# EAGLE design temp_sensing (EAGLE 9.5.2)
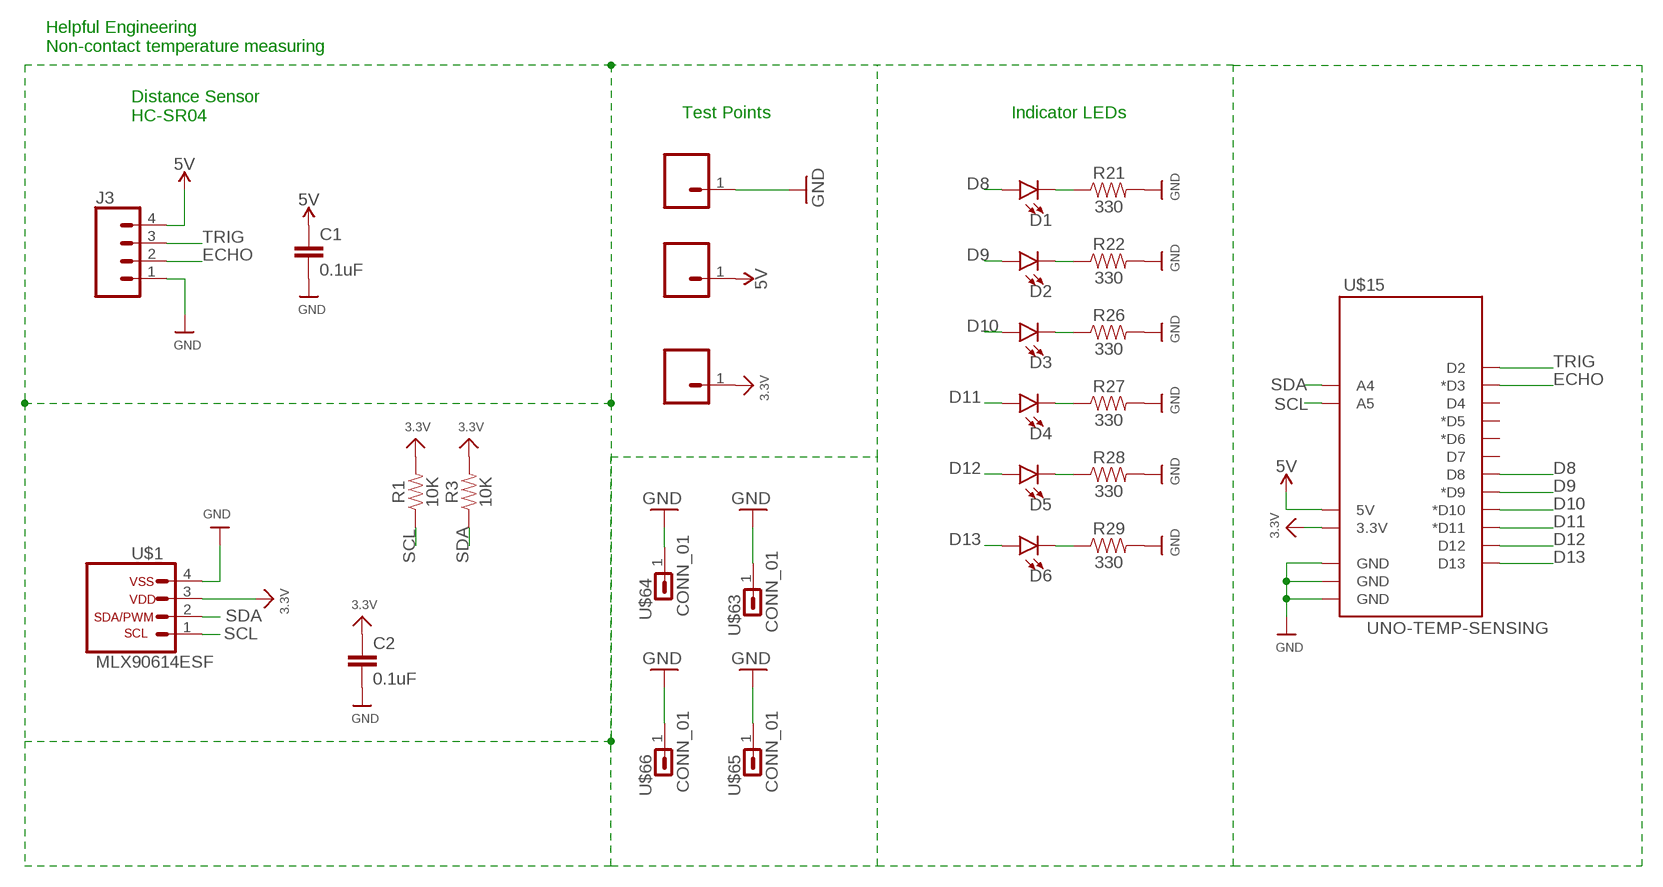
[diagram p0: schematic, sheet 1]

## Parts
C1  0.1uF  0.1UF-KIT-EZ-50V-20%  [CAP-PTH-SMALL-KIT]
C2  0.1uF  0.1UF-KIT-EZ-50V-20%  [CAP-PTH-SMALL-KIT]
D1  LED10MM  [LED_10MM]
D2  LED10MM  [LED_10MM]
D3  LED10MM  [LED_10MM]
D4  LED10MM  [LED_10MM]
D5  LED10MM  [LED_10MM]
D6  LED10MM  [LED_10MM]
J3  CONN_04PTH  [1X04]
R1  10K  330OHM-HORIZ-1/10W-5%  [AXIAL-0.3]
R3  10K  330OHM-HORIZ-1/10W-5%  [AXIAL-0.3]
R21  330  330OHM-HORIZ-1/10W-5%  [AXIAL-0.3]
R22  330  330OHM-HORIZ-1/10W-5%  [AXIAL-0.3]
R26  330  330OHM-HORIZ-1/10W-5%  [AXIAL-0.3]
R27  330  330OHM-HORIZ-1/10W-5%  [AXIAL-0.3]
R28  330  330OHM-HORIZ-1/10W-5%  [AXIAL-0.3]
R29  330  330OHM-HORIZ-1/10W-5%  [AXIAL-0.3]
U$1  MLX90614ESF  [MLX90614XCI]
U$15  UNO-TEMP-SENSING  [UNO_FOOTRPINT]
U$20  CONN_0138MILL  [1X01-40MILL]
U$31  CONN_0138MILL  [1X01-40MILL]
U$59  CONN_0138MILL  [1X01-40MILL]
U$63  CONN_01  [1X01-#6_MACHINE]
U$64  CONN_01  [1X01-#6_MACHINE]
U$65  CONN_01  [1X01-#6_MACHINE]
U$66  CONN_01  [1X01-#6_MACHINE]

## Nets
3.3V: C2.1 R1.P$2 R3.P$2 U$1.3 U$15.3.3V U$20.1
5V: C1.1 J3.4 U$15.5V U$59.1
D8: D1.A U$15.D8
D9: D2.A U$15.D9(*D9)
D10: D3.A U$15.D10(*D10)
D11: D4.A U$15.D11(*D11)
D12: D5.A U$15.D12
D13: D6.A U$15.D13
ECHO: J3.2 U$15.D3(*D3)
GND: C1.2 C2.2 J3.1 R21.P$2 R22.P$2 R26.P$2 R27.P$2 R28.P$2 R29.P$2 U$1.4 U$15.GND@0(GND) U$15.GND@1(GND) U$15.GND@2(GND) U$31.1 U$63.1 U$64.1 U$65.1 U$66.1
N$1: D6.C R29.P$1
N$18: D1.C R21.P$1
N$19: D2.C R22.P$1
N$20: D3.C R26.P$1
N$21: D4.C R27.P$1
N$22: D5.C R28.P$1
SCL: R1.P$1 U$1.1 U$15.A5
SDA: R3.P$1 U$1.2 U$15.A4
TRIG: J3.3 U$15.D2
Unconnected: U$15.D4 U$15.D5(*D5) U$15.D6(*D6) U$15.D7

## Notes on the sheet
- Helpful Engineering
  Non-contact temperature measuring
- Test Points | Indicator LEDs
- Distance Sensor
  HC-SR04

## Library data of the parts
C1 C2 = SparkFun-Capacitors:0.1UF: 0.1µF ceramic capacitors A capacitor is a passive two-terminal electrical component used to store electrical energy temporarily in an electric field.; PROD_ID: CAP-08370
D1-D6 = SparkFun-LED:LED: LED (Generic) Standard schematic elements and footprints for 5mm, 3mm, 1206, and 0603 sized LEDs. Generic LEDs with no color specified.
J3 = SparkFun-Connectors:CONN_04: Multi connection point. Often used as Generic Header-pin footprint for 0.1 inch spaced/style header connections On any of the 0.1 inch spaced packages, you can populate with these: Break Away Headers - Straight <https://www.sparkfun.com/products/116> (PRT-00116) Break Away Male Headers - Right Angle <https://www.sparkfun.com/products/553> (PRT-00553) Female Headers <https://www.sparkfun.com/products/115> (PRT-00115) Break Away Headers - Machine Pin <https://www.sparkfun.com/products/117> (PRT-00117) Break Away Female Headers - Swiss Machine Pin <https://www.sparkfun.com/products/743> (PRT-00743) For SCREWTERMINALS and SPRING TERMINALS visit here: Screw Terimnals on SparkFun.com <https://www.sparkfun.com/search/results?term=Screw+Terminals> (5mm/3.5mm/2.54mm spacing) This device is also useful as a general connection point to wire up your design to another part of your project. Our various solder wires solder well into these plated through hole pads. Hook-Up Wire - Assortment (Stranded, 22 AWG) <https://www.sparkfun.com/products/11375> (PRT-11375) Hook-Up Wire - Assortment (Solid Core, 22 AWG) <https://www.sparkfun.com/products/11367> (PRT-11367) View the entire wire category on our website here <https://www.sparkfun.com/categories/141> Special notes: Molex polarized connector foot print use with SKU : PRT-08231 with associated crimp pins and housings. 1MM SMD Version SKU: PRT-10208; PROD_ID: CONN-09696
R1 R3 = SparkFun-Resistors:330OHM: 330Ω resistor A resistor is a passive two-terminal electrical component that implements electrical resistance as a circuit element. Resistors act to reduce current flow, and, at the same time, act to lower voltage levels within circuits. - Wikipedia; PROD_ID: RES-8371; VALUE: 330
R21 R22 R26-R29 = SparkFun-Resistors:330OHM: 330Ω resistor A resistor is a passive two-terminal electrical component that implements electrical resistance as a circuit element. Resistors act to reduce current flow, and, at the same time, act to lower voltage levels within circuits. - Wikipedia; PROD_ID: RES-8371
U$1 = th_libraries:MLX90614ESF: MLX90614xCI https://www.melexis.com/-/media/files/documents/datasheets/mlx90614-datasheet-melexis.pdf pg. 52
U$15 = th_libraries:UNO-TEMP-SENSING: Helpful Engineering Temperature Sensing Uno
U$20 U$31 U$59 = th_libraries3:CONN_01: #6 Machine Screw tite - 144mil hole, 256mil diameter
U$63-U$66 = th_libraries:CONN_01: #6 Machine Screw tite - 144mil hole, 256mil diameter

## Net classes
1 highpower: width 0.305 mm, drill 0.483 mm
2 lowpower: width 0.305 mm, drill 0.483 mm

## Board
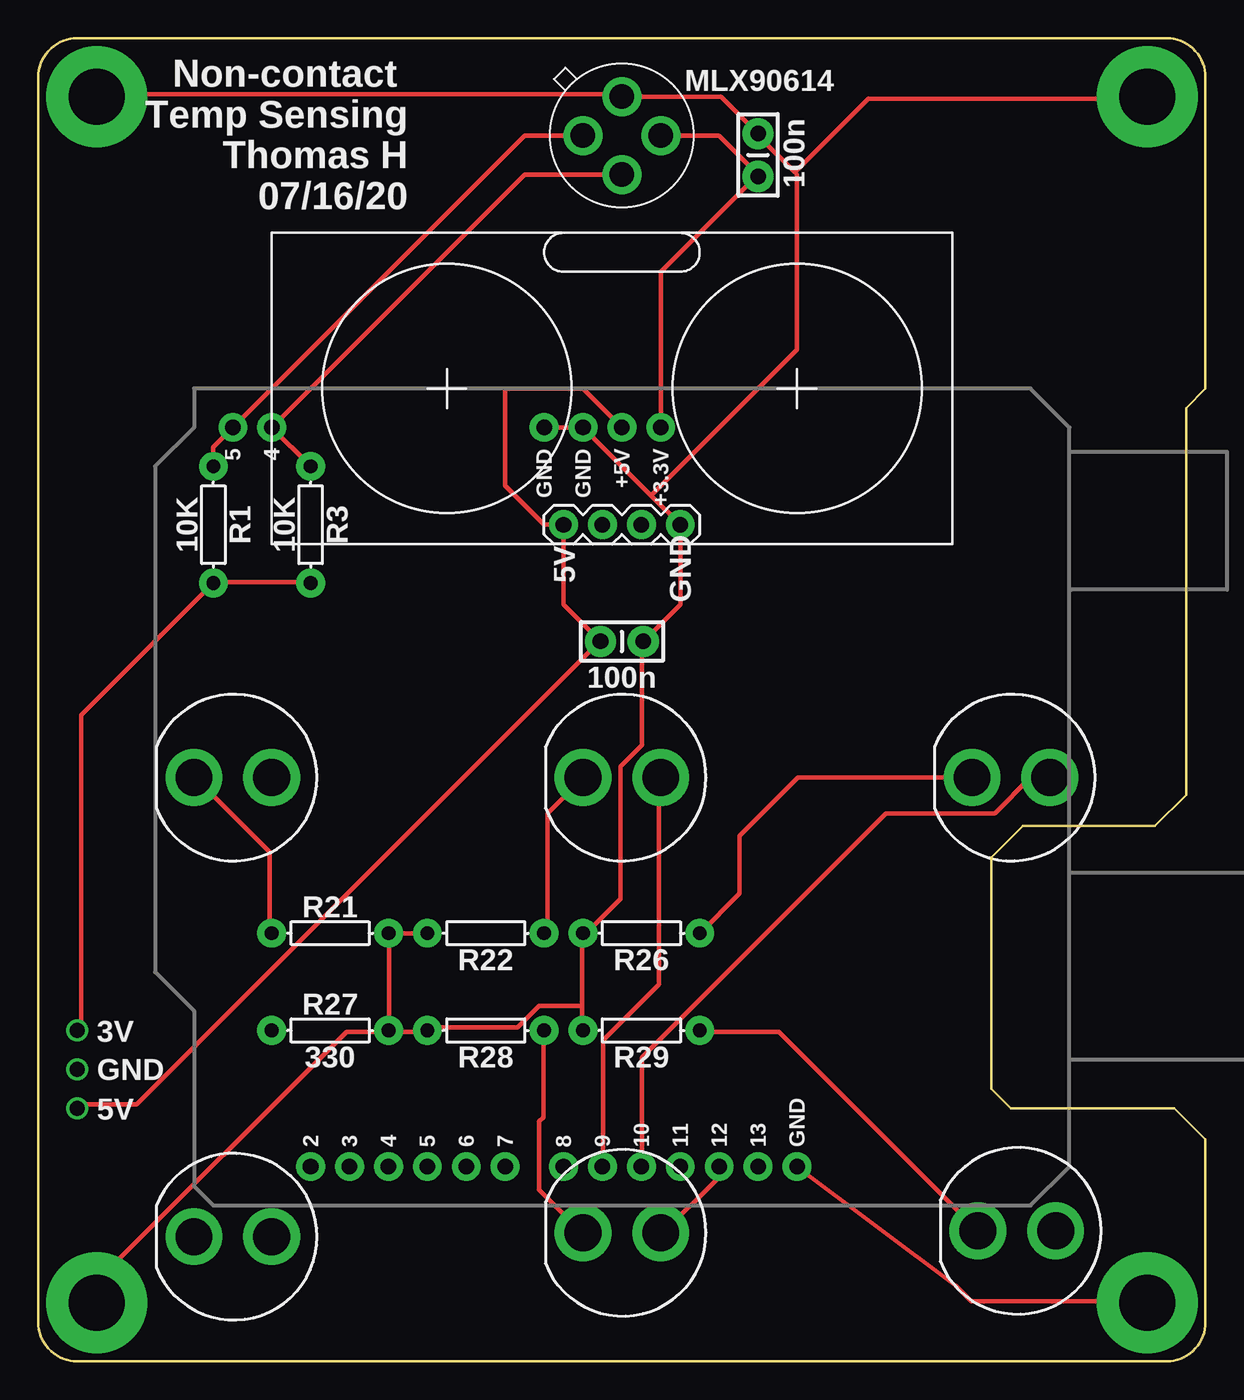
[diagram p1: board, top side]
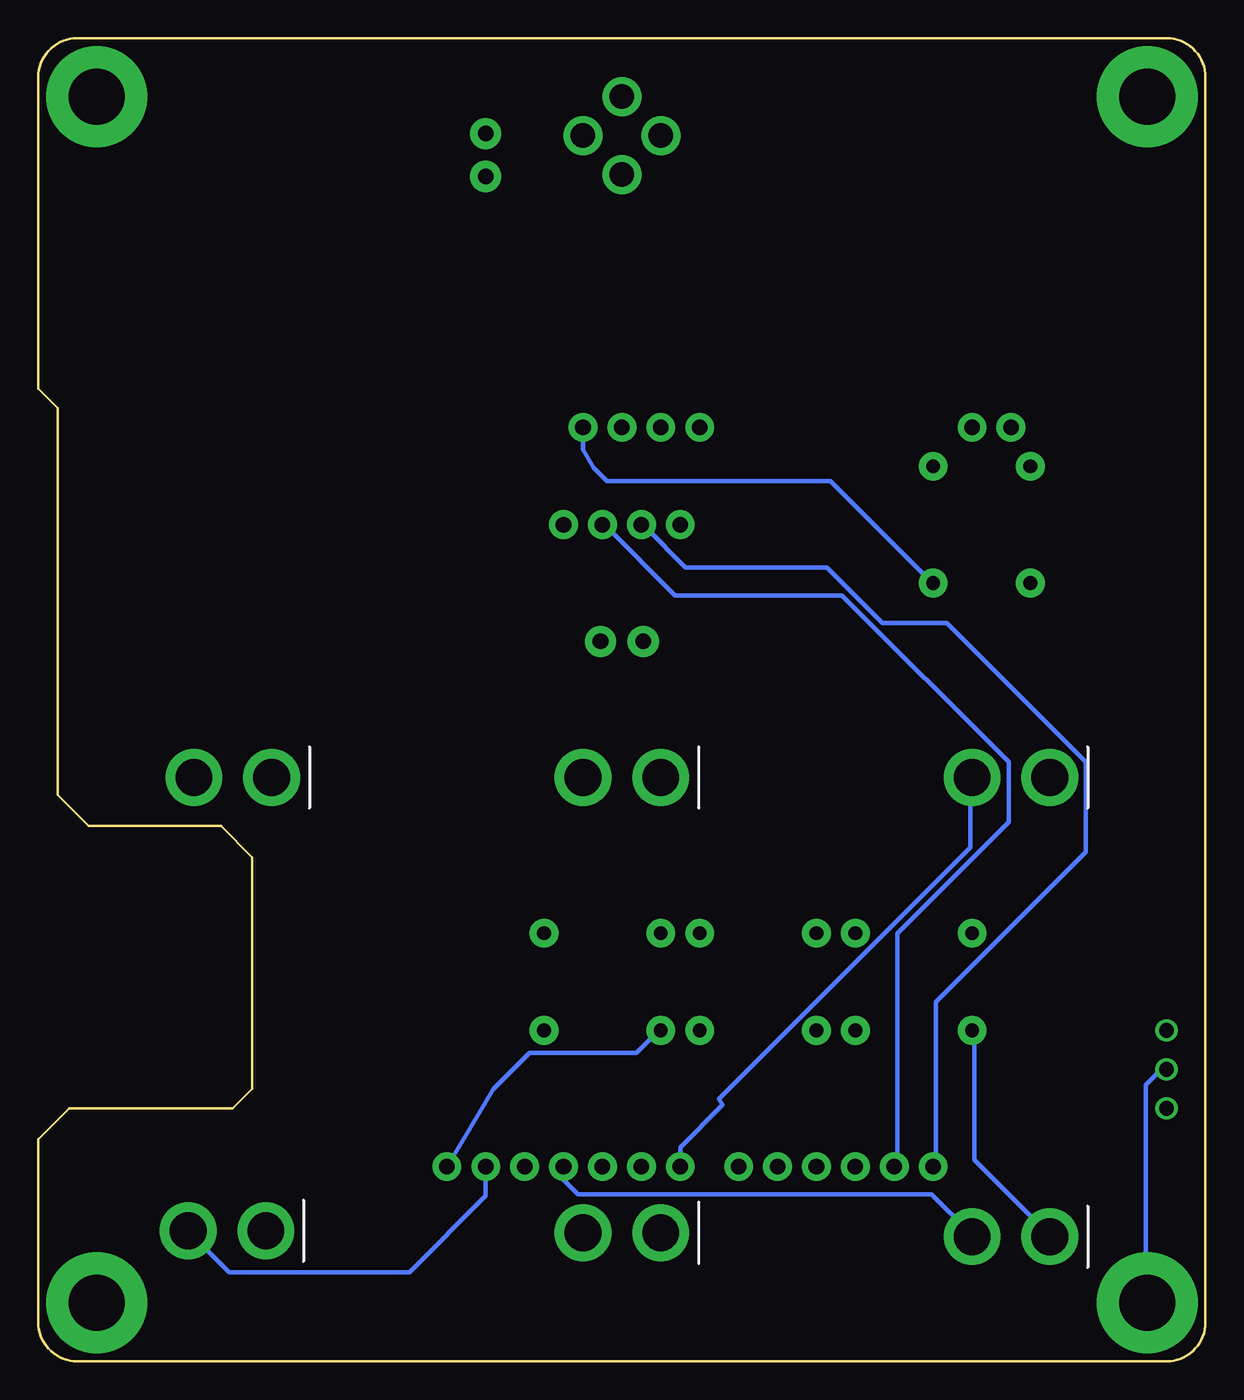
[diagram p2: board, bottom side, seen from below]

Size 76.2 x 86.36 mm. Coordinates in mm from the lower left corner, seen from the top.
Outline: 73.66,0 2.54,0 arc-90 0,2.54 0,83.82 arc-90 2.54,86.36 73.66,86.36 arc-90 76.2,83.82 76.2,63.5 74.93,62.23 74.93,36.96 72.9,34.92 64.26,34.92 62.23,32.89 62.23,17.78 63.5,16.51 74.17,16.51 76.2,14.48 76.2,2.54 arc-90 73.66,0
Copper layers (1*16): Top 0.0356mm / dielectric 1.5011mm / Bottom 0.0356mm
Design rules "LaenPCBOrder *": minimum track width 12mil, minimum drill 13mil, track to track 10mil, track to pad 10mil, pad to pad 10mil, via to via 10mil, smd to smd 8mil, copper to edge 15mil, drill to drill 6mil, minimum pad ring 7mil, minimum via ring 7mil, stop-mask expansion 3mil, vias tented up to drill 25mil, thermal gap 10mil

### Footprints (pad centres in the part's own frame; a part is rotated, then mirrored left to right if it is on the bottom)
CAP-PTH-SMALL-KIT = drill 1.016 pad 2.032: 1 -1.397,0; 2 1.397,0
LED_10MM = drill 2.4 pad 3.7: A 2.54,0; C -2.54,0
1X04 = drill 1.016 pad 1.88: 1 0,0; 2 2.54,0; 3 5.08,0; 4 7.62,0
AXIAL-0.3 = drill 0.9 pad 1.88: P$1 -3.81,0; P$2 3.81,0
MLX90614XCI = drill 1.6 pad 2.54: 1 -2.54,0; 2 0,-2.54; 3 2.54,0; 4 0,2.54
UNO_FOOTRPINT = drill 1.016 pad 1.88: 3.3V -13.97,52.07; 5V -13.97,54.61; A4 -13.97,77.47; A5 -13.97,80.01; D2 -62.23,74.93; D3 -62.23,72.39; D4 -62.23,69.85; D5 -62.23,67.31; D6 -62.23,64.77; D7 -62.23,62.23; D8 -62.23,58.42; D9 -62.23,55.88; D10 -62.23,53.34; D11 -62.23,50.8; D12 -62.23,48.26; D13 -62.23,45.72; GND@0 -13.97,57.15; GND@1 -13.97,59.69; GND@2 -62.23,43.18
1X01-40MILL = drill 0.965 pad 1.397: 1 0,0
1X01-#6_MACHINE = drill 3.658 pad 6.604: 1 0,0

### Placement (x,y rotation side)
C1  38.1,46.99 0 top
C2  46.99,78.74 90 top
D1  12.7,38.1 0 top
D2  38.1,38.1 0 top
D3  63.5,38.1 0 top
D4  12.7,8.13 0 top
D5  38.1,8.38 0 top
D6  63.88,8.51 0 top
J3  41.91,54.61 180 top
R1  11.43,54.61 270 top
R3  17.78,54.61 270 top
R21  19.05,27.94 0 top
R22  29.21,27.94 180 top
R26  39.37,27.94 180 top
R27  19.05,21.59 0 top
R28  29.21,21.59 180 top
R29  39.37,21.59 180 top
U$1  38.1,80.01 0 top
U$15  92.71,74.93 90 top
U$20  2.54,21.59 270 top
U$31  2.54,19.05 270 top
U$59  2.54,16.51 0 top
U$63  72.39,82.55 0 top
U$64  3.81,3.81 0 top
U$65  3.81,82.55 0 top
U$66  72.39,3.81 0 top

### Tracks (layer width: path | path; a pad name or v marks a point on that pad's centre or on a via)
3.3V
  Top 0.305: U$1.3 44.45,80.01 46.99,77.47 | 46.99,77.47 C2.1 | U$15.3.3V 40.64,71.12 46.99,77.47 | U$20.1 2.79,21.79 2.79,42.19 11.18,50.57 R1.P$2 11.46,50.85 17.6,50.85 R3.P$2
  Bottom 0.305: U$15.3.3V 40.64,59.49 39.94,58.33 39.06,57.45 24.49,57.45 17.88,50.85 R3.P$2
5V
  Top 0.305: U$15.5V 35.56,63.5 30.48,63.5 30.48,57.15 33.02,54.61 J3.4 34.29,49.4 C1.1 36.6,46.94 6.43,16.76 2.79,16.76 U$59.1
D8
  Bottom 0.305: U$15.D8 34.29,13.97 31.52,16.73 31.77,17.12 15.37,33.53 15.37,38 D1.A
D9
  Top 0.305: U$15.D9 36.88,12.83 36.88,20.95 40.51,24.59 40.51,38 D2.A
D10
  Top 0.305: D3.A 64.77,38.1 62.43,35.76 55.32,35.76 39.4,19.84 39.4,12.83 U$15.D10
D11
  Bottom 0.305: U$15.D11 41.91,11.84 40.97,10.9 17.88,10.9 15.37,8.38 D4.A
D12
  Top 0.305: U$15.D12 44.42,12.55 44.42,12.01 40.79,8.38 D5.A
D13
  Bottom 0.305: U$15.D13 46.99,10.79 51.97,5.82 63.73,5.82 D6.A
ECHO
  Bottom 0.305: U$15.D3 20.12,12.83 20.12,27.94 12.85,35.2 12.85,39.12 23.72,49.99 34.62,49.99 39.12,54.48 J3.2
GND
  Top 0.305: 40.01,56.52 J3.1 41.91,49.4 C1.2 39.4,46.94 39.4,40.23 38,38.84 38,30.18 35.76,27.94 R26.P$2 35.48,27.94 35.48,23.19 | 40.01,56.52 U$15.GND@0 U$15.GND@1 | 40.01,56.52 49.53,66.04 49.53,77.47 49.39,77.61 | 49.39,77.61 46.99,80.01 C2.2 44.58,82.55 U$1.4 38,82.7 3.91,82.7 U$65.1 | 49.39,77.61 54.2,82.42 72.36,82.42 U$63.1 | R27.P$2 22.91,21.51 25.15,21.51 R28.P$2 25.43,21.79 31.29,21.79 32.69,23.19 35.48,23.19 | R22.P$2 22.91,27.94 | 22.91,27.94 22.91,21.79 R27.P$2 | 22.91,27.94 R21.P$2 | 35.48,23.19 35.48,21.79 R29.P$2 | U$66.1 72.36,3.91 60.91,3.91 59.89,4.93 U$15.GND@2 | U$64.1 3.91,3.91 3.91,5.31 20.12,21.51 22.63,21.51 R27.P$2
  Bottom 0.305: U$31.1 2.9,19.05 3.91,18.03 3.91,3.91 U$64.1 | U$15.GND@2 46.48,17.78 44.15,20.12 37.16,20.12 35.76,21.51 R29.P$2
N$1
  Top 0.305: D6.C 48.34,21.51 43.31,21.51 R29.P$1
N$18
  Top 0.305: R21.P$1 15.09,27.94 15.09,33.25 10.34,38 D1.C
N$19
  Top 0.305: R22.P$1 33.25,27.94 33.25,35.76 35.48,38 D2.C
N$20
  Top 0.305: R26.P$1 45.77,30.53 45.77,34.29 49.58,38.1 D3.C
N$21
  Bottom 0.305: R27.P$1 15.09,21.51 15.09,13.13 10.34,8.38 D4.C
N$22
  Top 0.305: R28.P$1 32.97,21.51 32.97,15.93 32.69,15.65 32.69,11.18 35.48,8.38 D5.C
SCL
  Top 0.305: U$1.1 31.75,80.01 U$15.A5 11.43,59.69 R1.P$1
SDA
  Top 0.305: U$1.2 31.75,77.47 U$15.A4 R3.P$1
TRIG
  Bottom 0.305: U$15.D2 17.6,12.83 17.6,23.47 7.82,33.25 7.82,39.12 16.89,48.18 21.08,48.18 24.71,51.82 33.93,51.82 36.6,54.48 J3.3

### Text on the board
tPlace: Non-contact / Temp Sensing / Thomas H / 07/16/20 | MLX90614 | 100n | 5V | GND | 100n | 3V | GND | 5V